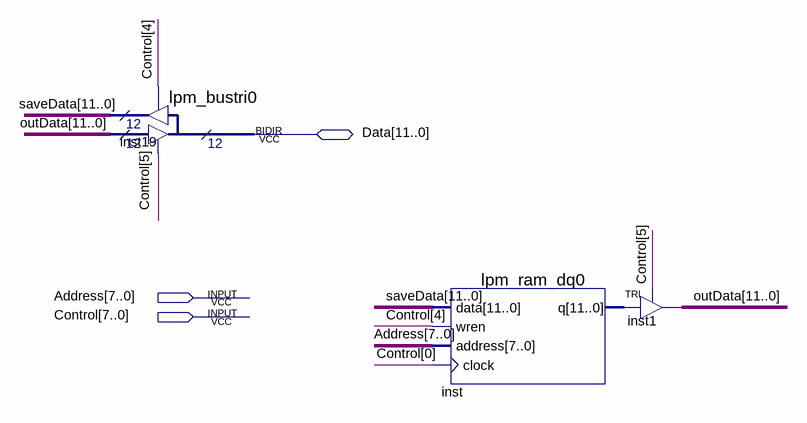
[diagram p0: schematic sheet]
// Quartus schematic ram.bdf as structural Verilog: 3 symbols, 3 pins
module ram (
  input  [7:0] Address,
  input  [7:0] Control,
  inout  [11:0] Data
);

  wire [11:0] inst_q, outData, saveData;

  lpm_bustri0 inst19 (.enabledt(Control[5]), .data(outData), .enabletr(Control[4]), .result(saveData), .tridata(Data));
  lpm_ram_dq0 inst (.data(saveData), .wren(Control[4]), .address(Address), .clock(Control[0]), .q(inst_q));
  TRI inst1[11:0] (.IN(inst_q), .OE(Control[5]), .OUT(outData));
endmodule
